# EAGLE schematic Amplifier (EAGLE 9.3.0)
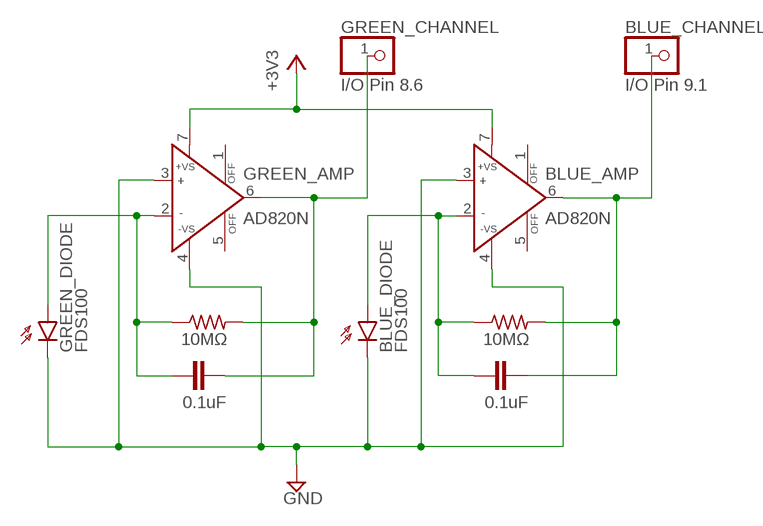
[diagram p0: schematic, sheet 1]

## Parts
BLUE_AMP  AD820N  [DIL08]
BLUE_CHANNEL  I/O Pin 9.1  PINHD-1X1  [1X01]
BLUE_DIODE  FDS100  BPX65  [BPX65]
C1  0.1uF  C2,5-3  [C2.5-3]
C2  0.1uF  C2,5-3  [C2.5-3]
GREEN_AMP  AD820N  [DIL08]
GREEN_CHANNEL  I/O Pin 8.6  PINHD-1X1  [1X01]
GREEN_DIODE  FDS100  BPX65  [BPX65]
R1  10MΩ  R-US_0207/12  [0207/12]
R2  10MΩ  R-US_0207/12  [0207/12]

## Nets
+3V3: BLUE_AMP.7(+VS) GREEN_AMP.7(+VS)
GND: BLUE_AMP.3(IN+) BLUE_AMP.4(-VS) BLUE_DIODE.K(C) GREEN_AMP.3(IN+) GREEN_AMP.4(-VS) GREEN_DIODE.K(C)
N$1: C1.2 GREEN_AMP.2(IN-) GREEN_DIODE.A R1.1
N$2: C1.1 GREEN_AMP.6(OUT) GREEN_CHANNEL.1 R1.2
N$3: BLUE_AMP.6(OUT) BLUE_CHANNEL.1 C2.1 R2.2
N$4: BLUE_AMP.2(IN-) BLUE_DIODE.A C2.2 R2.1
Unconnected: BLUE_AMP.1(OFF) BLUE_AMP.5(OFF) GREEN_AMP.1(OFF) GREEN_AMP.5(OFF)

## Library data of the parts
BLUE_AMP GREEN_AMP = analog-devices:AD820N: Single-Supply, Rail-to-Rail, Low Power, FET Input Op Amp Source: http://www.analog.com/static/imported-files/data_sheets/AD820.pdf; OC_FARNELL: 1438579; OC_NEWARK: unknown
BLUE_CHANNEL GREEN_CHANNEL = pinhead:PINHD-1X1: PIN HEADER
BLUE_DIODE GREEN_DIODE = opto-trans-siemens:BPX65: PHOTO DIODE; MPN: BPX65.; OC_FARNELL: 327451; OC_NEWARK: 06WX2764
C1 C2 = capacitor-wima:C: CAPACITOR naming: grid - package width
R1 R2 = rcl:R-US_: RESISTOR, American symbol; SPICEPREFIX: R